# Altium schematic sheet norbi_lm_trm.SchDoc: Имя
size 209 x 297 mm; ApprovedBy: Утвердил; CheckedBy: Проверил; Author: Разработал; Organization: НГУ; DocumentNumber: Децимальный номер Э3; SheetNumber: Лист; SheetTotal: Листов; PageSetup: Record=PageOptions|CenterHorizontal=True|CenterVertical=True|PrintScale=1.00|XCorrection=1.00|YCorrection=1.00|PrintKind=1|BorderSize=5000000|LeftOffset=0|BottomOffset=0|Orientation=2|PaperLength=1000|PaperWidth=1000|Scale=100|PaperSource=15|PrintQuality=1200|MediaType=1|DitherType=10|PaperKind=A3|PrintScaleMode=1; Weight: -; ScaleFactor: -; NormInspection: Норм.Контр.
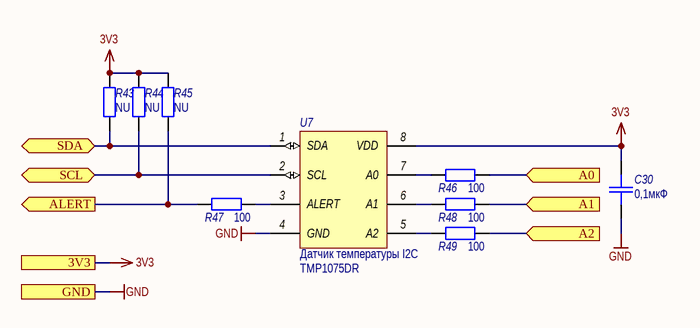
[diagram p0: norbi_lm_trm.SchDoc]

## Parts
C30  0,1мкФ  [CR-0603]
R43  NU  [CR-0603]
R44  NU  [CR-0603]
R45  NU  [CR-0603]
R46  100  [CR-0603]
R47  100  [CR-0603]
R48  100  [CR-0603]
R49  100  [CR-0603]
U7  Назначение: Датчик температуры I2C  Наименование: TMP1075DR  [SOIC-8]  (hidden comment: TMP1075)

## Ports
3V3, A0 (in), A1 (in), A2 (in), ALERT (out), GND, SCL (bidir), SDA (bidir)

## Nets
3V3: C30.2 R43.2 R44.2 R45.2 U7.8(VDD) ; port 3V3
GND: C30.1 U7.4(GND) ; port GND
A0: R46.1 ; port A0
A1: R48.1 ; port A1
A2: R49.1 ; port A2
ALERT: R45.1 R47.2 ; port ALERT
SCL: R44.1 U7.2(SCL) ; port SCL
SDA: R43.1 U7.1(SDA) ; port SDA
NetR46_2: R46.2 U7.7(A0)
NetR47_1: R47.1 U7.3(ALERT)
NetR48_2: R48.2 U7.6(A1)
NetR49_2: R49.2 U7.5(A2)

## Notes on the sheet
- Подп. и дата
- Инв. № дубл.
- Взам. инв. №
- Инв. № подл.
- Изм.
- Лист
- № докум.
- Подп.
- Дата
- Форма 2а ГОСТ 2.104-2006
- Копировал
- Формат А4

## Library data of the parts
C30 = C_smd: Конденсатор для поверхностного монтажа; Назначение: Чип-конденсатор; Потребление, Вт: 0; Наименование: SMD-0603; Value: 0,1мкФ
R43-R45 = R_smd: Резистор для поверхностного монтажа; Назначение: Чип-резистор; Наименование: SMD-0603 20%; Потребление, Вт: 0,001; Value: NU
R46-R49 = R_smd: Резистор для поверхностного монтажа; Наименование: SMD-0603 20%; Назначение: Чип-резистор; Потребление, Вт: 0,001; Value: 100
U7 = TMP1075: TMP1075 Temperature Sensor With I2C and SMBus Interface; Потребление, Вт: 0,001; ComponentLink1Description: Datasheet; ComponentLink1URL: http://www.ti.com/lit/ds/symlink/tmp1075.pdf